# Altium schematic sheet com.SchDoc
size A4
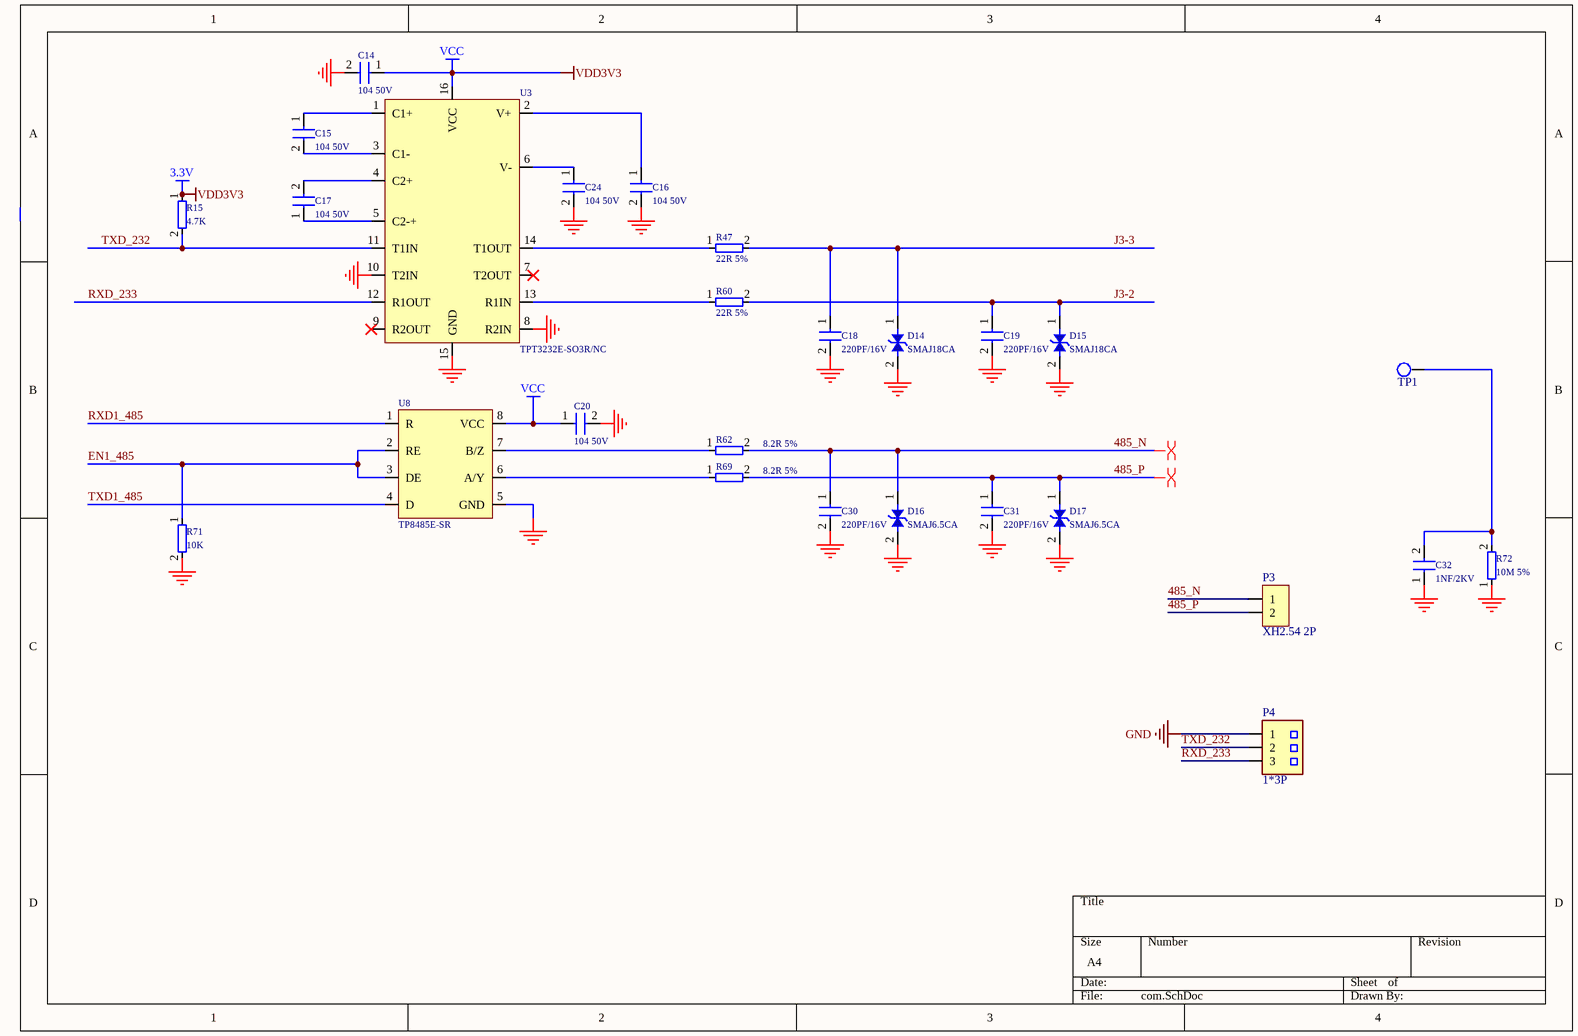
[diagram p0: com.SchDoc]

## Parts
C14  104 50V  [0603C]
C15  104 50V  [0603C]
C16  104 50V  [0603C]
C17  104 50V  [0603C]
C18  220PF/16V  [0603C]
C19  220PF/16V  [0603C]
C20  104 50V  [0603C]
C24  104 50V  [0603C]
C30  220PF/16V  [0603C]
C31  220PF/16V  [0603C]
C32  1NF/2KV  [1206C]
D14  SMAJ18CA  [SMA]
D15  SMAJ18CA  [SMA]
D16  SMAJ6.5CA  [SMA]
D17  SMAJ6.5CA  [SMA]
P3  XH2.54 2P  [SIP-2A]
P4  1*3P  [3X2.54MMZ2]
R15  4.7K  [0603R]
R47  22R 5%  [0603R]
R60  22R 5%  [0603R]
R62  8.2R 5%  [0603R]
R69  8.2R 5%  [0603R]
R71  10K  [0603R]
R72  10M 5%  [1206r]
TP1  TPS  [tpd]  (value not drawn)
U3  TPT3232E-SO3R/NC  [SO-16Z]
U8  TP8485E-SR  [SO-8]

## Nets
3.3V: C14.1 C20.1 R15.1 U3.16(VCC) U8.8(VCC)  [also labelled VCC, VDD3V3]
GND: C14.2 C16.2 C18.2 C19.2 C20.2 C24.2 C30.2 C31.2 C32.1 D14.2 D15.2 D16.2 D17.2 P4.1 R71.2 R72.1 U3.8(R2IN) U3.10(T2IN) U3.15(GND) U8.5(GND)
485_N: C30.1 D16.1 P3.1 R62.2
485_P: C31.1 D17.1 P3.2 R69.2
EN1_485: R71.1 U8.2(RE) U8.3(DE)
J3-2: C19.1 D15.1 R60.2
J3-3: C18.1 D14.1 R47.2
RXD1_485: U8.1(R)
RXD_233: P4.3 U3.12(R1OUT)
TXD1_485: U8.4(D)
TXD_232: P4.2 R15.2 U3.11(T1IN)
NetC15_1: C15.1 U3.1(C1+)
NetC15_2: C15.2 U3.3(C1-)
NetC16_1: C16.1 U3.2(V+)
NetC17_1: C17.1 U3.5(C2-+)
NetC17_2: C17.2 U3.4(C2+)
NetC24_1: C24.1 U3.6(V-)
NetC32_2: C32.2 R72.2 TP1.1
NetR47_1: R47.1 U3.14(T1OUT)
NetR60_1: R60.1 U3.13(R1IN)
NetR62_1: R62.1 U8.7(B/Z)
NetR69_1: R69.1 U8.6(A/Y)

Not connected (* = marked no-connect by the designer): U3 7(T2OUT)* 9(R2OUT)*

## Layout directives
differential pair: 485_N, 485_P

## Library data of the parts
C14-C20 C24 C30-C32 = CAP
D14-D17 = D_ESD
P3 = SIP-2: XH2.54 2P 直插
P4 = HDR1*3
R15 R47 R60 R62 R69 R71 R72 = RES
U3 = TPT3232E-SO3R